# EAGLE design robo-tito2Eric (EAGLE 7.5.0)
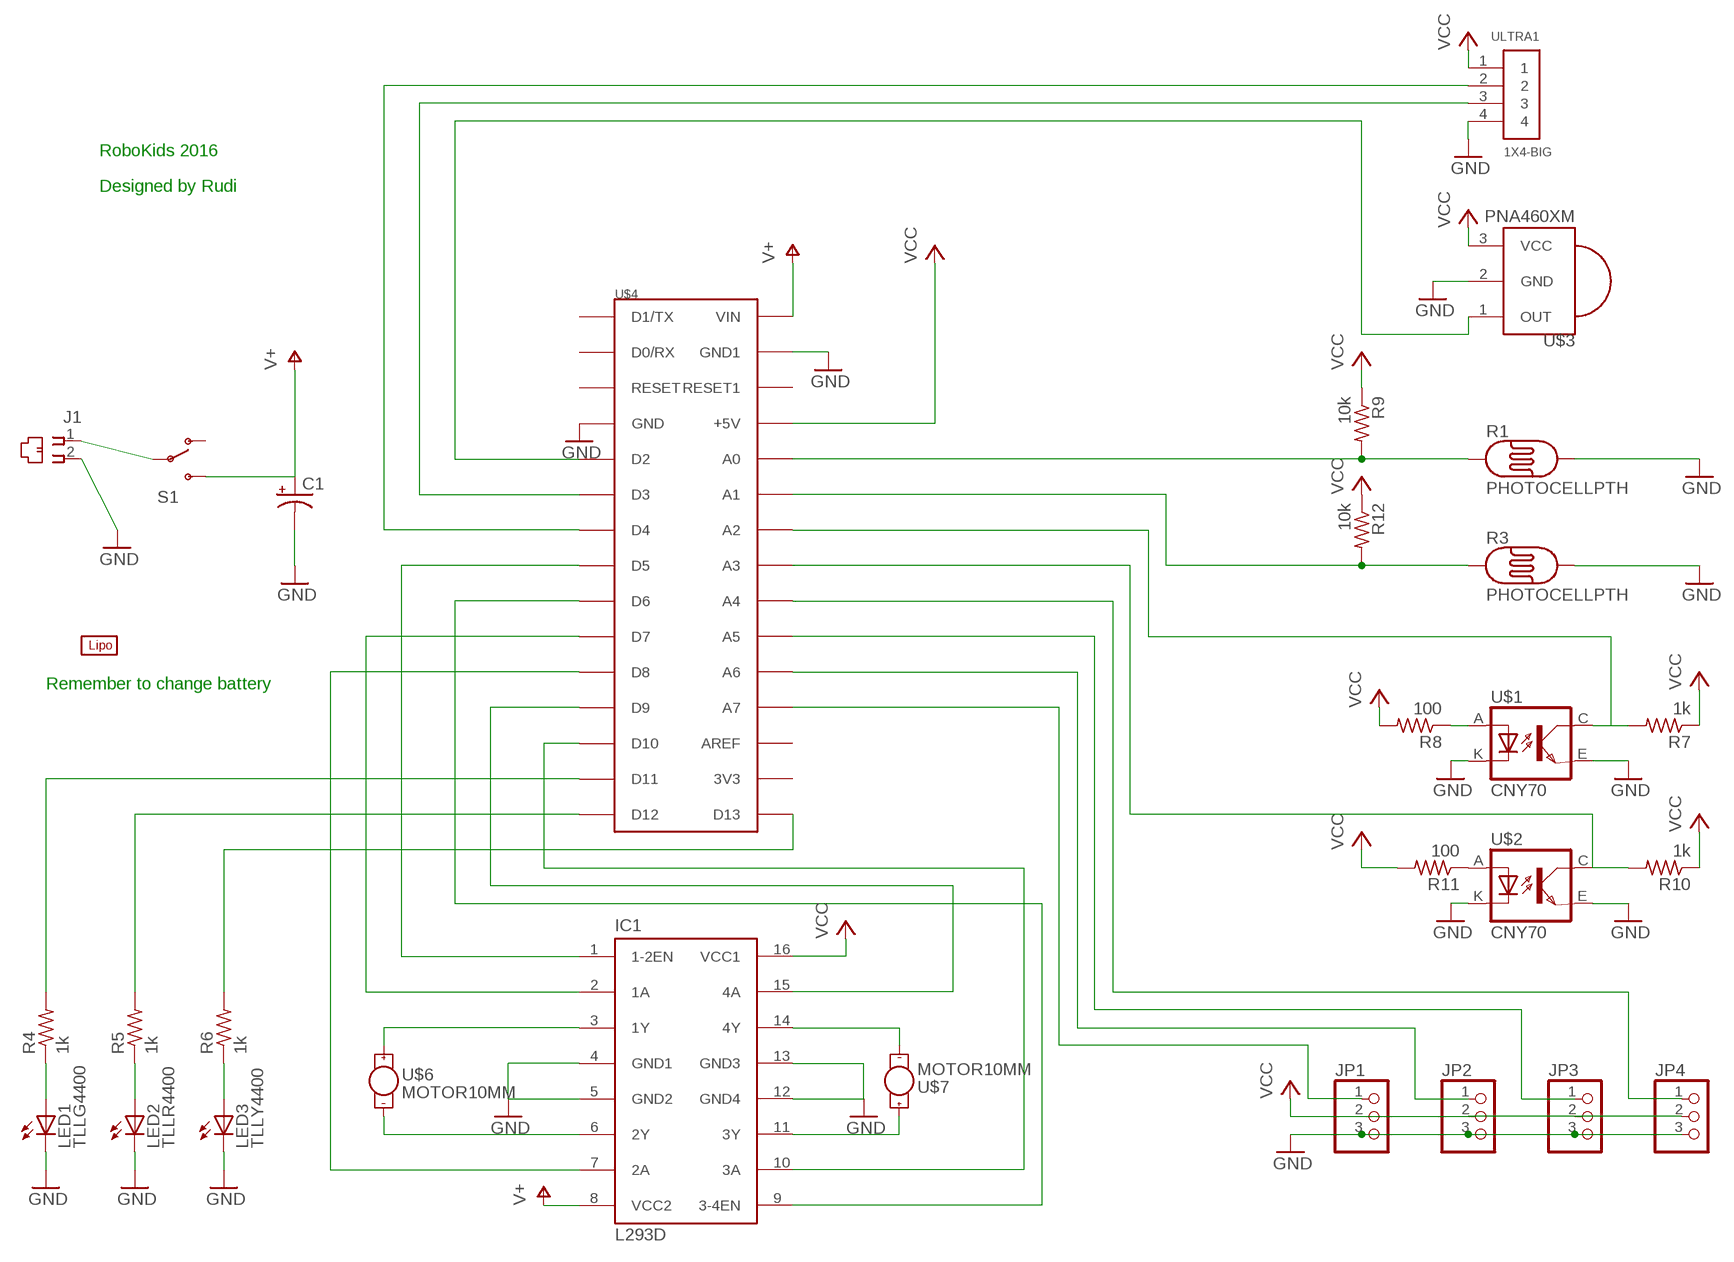
[diagram p0: schematic, sheet 1]

## Parts
C1  CPOL-USE10-20  [EB20D]
IC1  L293D  [DIL16]
J1  215876-7  [215876-7]
JP1  PINHD-1X3  [1X03]
JP2  PINHD-1X3  [1X03]
JP3  PINHD-1X3  [1X03]
JP4  PINHD-1X3  [1X03]
LED1  TLLG4400  [LED3MM]
LED2  TLLR4400  [LED3MM]
LED3  TLLY4400  [LED3MM]
R1  PHOTOCELLPTH  [PHOTOCELL]
R3  PHOTOCELLPTH  [PHOTOCELL]
R4  1k  R-US_0207/12  [0207/12]
R5  1k  R-US_0207/12  [0207/12]
R6  1k  R-US_0207/12  [0207/12]
R7  1k  R-US_0207/12  [0207/12]
R8  100  R-US_0207/12  [0207/12]
R9  10k  R-US_0207/12  [0207/12]
R10  1k  R-US_0207/12  [0207/12]
R11  100  R-US_0207/12  [0207/12]
R12  10k  R-US_0207/12  [0207/12]
S1  SWITCH-SPDTPTH2  [SWITCHE-DPDT]
U$1  CNY70  [4]
U$2  CNY70  [4]
U$3  PNA460XM  [PNA460XM]
U$4  ARDUINONANO  [PDIP-32]
U$5  LIPO-OUTLINE2000  [LIPO-2000]
U$6  MOTOR10MM  [VIBE-MOTOR-10MM]
U$7  MOTOR10MM  [VIBE-MOTOR-10MM]
ULTRA1  1X4-BIG  [1X04-BIG]

## Nets
GND: C1.- IC1.4(GND1) IC1.5(GND2) IC1.12(GND4) IC1.13(GND3) J1.2 JP1.3 JP2.3 JP3.3 JP4.3 LED1.K(C) LED2.K(C) LED3.K(C) R1.2 R3.2 U$1.E(EMI) U$1.K(C) U$2.E(EMI) U$2.K(C) U$3.2(GND) U$4.GND U$4.GND1 ULTRA1.4
N$1: LED1.A R4.1
N$2: LED2.A R5.1
N$3: LED3.A R6.1
N$4: IC1.2(1A) U$4.D7
N$5: IC1.7(2A) U$4.D8
N$6: IC1.15(4A) U$4.D9
N$7: IC1.10(3A) U$4.D10
N$8: IC1.1(1-2EN) U$4.D5
N$9: IC1.9(3-4EN) U$4.D6
N$10: IC1.3(1Y) U$6.+
N$11: IC1.6(2Y) U$6.-
N$12: IC1.14(4Y) U$7.-
N$13: IC1.11(3Y) U$7.+
N$14: R4.2 U$4.D11
N$15: R5.2 U$4.D12
N$16: R6.2 U$4.D13
N$17: U$4.A3
N$18: R7.2 U$1.C(COL) U$4.A2
N$19: R11.1 U$2.A
N$20: U$3.1(OUT) U$4.D2
N$21: J1.1 S1.2(P)
N$22: R8.1 U$1.A
N$23: JP1.1 U$4.A7
N$24: R1.1 R9.2 U$4.A0
N$25: R3.1 R12.2 U$4.A1
N$26: R10.2 U$2.C(COL)
N$27: U$4.D4 ULTRA1.2
N$28: U$4.D3 ULTRA1.3
N$29: JP2.1 U$4.A6
N$30: JP3.1 U$4.A5
N$31: JP4.1 U$4.A4
V+: C1.+ IC1.8(VCC2) S1.3(S) U$4.VIN
VCC: IC1.16(VCC1) JP1.2 JP2.2 JP3.2 JP4.2 R7.1 R8.2 R9.1 R10.1 R11.2 R12.1 U$3.3(VCC) U$4.+5V ULTRA1.1
Unconnected: S1.1(O) U$4.3V3 U$4.AREF U$4.D0/RX U$4.D1/TX U$4.RESET U$4.RESET1

## Notes on the sheet
- RoboKids 2016
- Designed by Rudi
- Remember to change battery

## Library data of the parts
C1 = adafruit:CPOL-US: POLARIZED CAPACITOR, American symbol
IC1 = st-microelectronics:L293D: PUSH-PULL 4 CHANNEL DRIVER; MPN: L293D; OC_FARNELL: 9589619; OC_NEWARK: 56P8249
J1 = con-amp:215876-7: AMP connector
JP1-JP4 = adafruit:PINHD-1X3: PIN HEADER
LED1 = led:TLLG4400: Low Current (2mA) LED 3 mm Tinted Diffused Package color GREEN Source: Data sheet <http://www.farnell.com/datasheets/391098.pdf>; MF: VISHAY SEMICONDUCTOR; OC_FARNELL: 1612435
LED2 = led:TLLR4400: Low Current (2mA) LED 3 mm Tinted Diffused Package color RED Source: Data sheet <http://www.farnell.com/datasheets/391100.pdf>; MF: VISHAY SEMICONDUCTOR; OC_FARNELL: 1612437
LED3 = led:TLLY4400: Low Current (2mA) LED 3 mm Tinted Diffused Package color YELLOW Source: Data sheet <http://www.farnell.com/datasheets/391098.pdf>; MF: VISHAY SEMICONDUCTOR; OC_FARNELL: 1612439
R1 R3 = SparkFun-Sensors:PHOTOCELL: CdS photoresistor. This is a low cost way to detect light levels. Resistance decreases with more incoming light. SparkFun SKU: SEN-09088
R4-R12 = adafruit:R-US_: RESISTOR, American symbol
S1 = SparkFun-Electromechanical:SWITCH-SPDT: SPDT Switch Simple slide switch, Spark Fun Electronics SKU : COM-00102 DPDT SMT slide switch, AYZ0202, SWCH-08179
U$1 U$2 = cny70:CNY70
U$3 = adafruit:PNA460XM: IR 38KHz receiver PNA4602 and related receivers http://www.ladyada.net/library/pcb/eaglelibrary.html
U$4 = jet-lib:ARDUINONANO: This is a simple part to represent Arduino NANO clon.
U$5 = SparkFun-Electromechanical:LIPO-OUTLINE: Outlines for common LiPo batteries sold by SparkFun. For fit only- no pads or connectors!
U$6 U$7 = SparkFun-Electromechanical:MOTOR: Vibration Motor- ROB-08449 Physical dimension and wire connections for this powerful vibration motor. Motor has a self adhesive backing.
ULTRA1 = adafruit:1X4: 4-pin connector

## Board
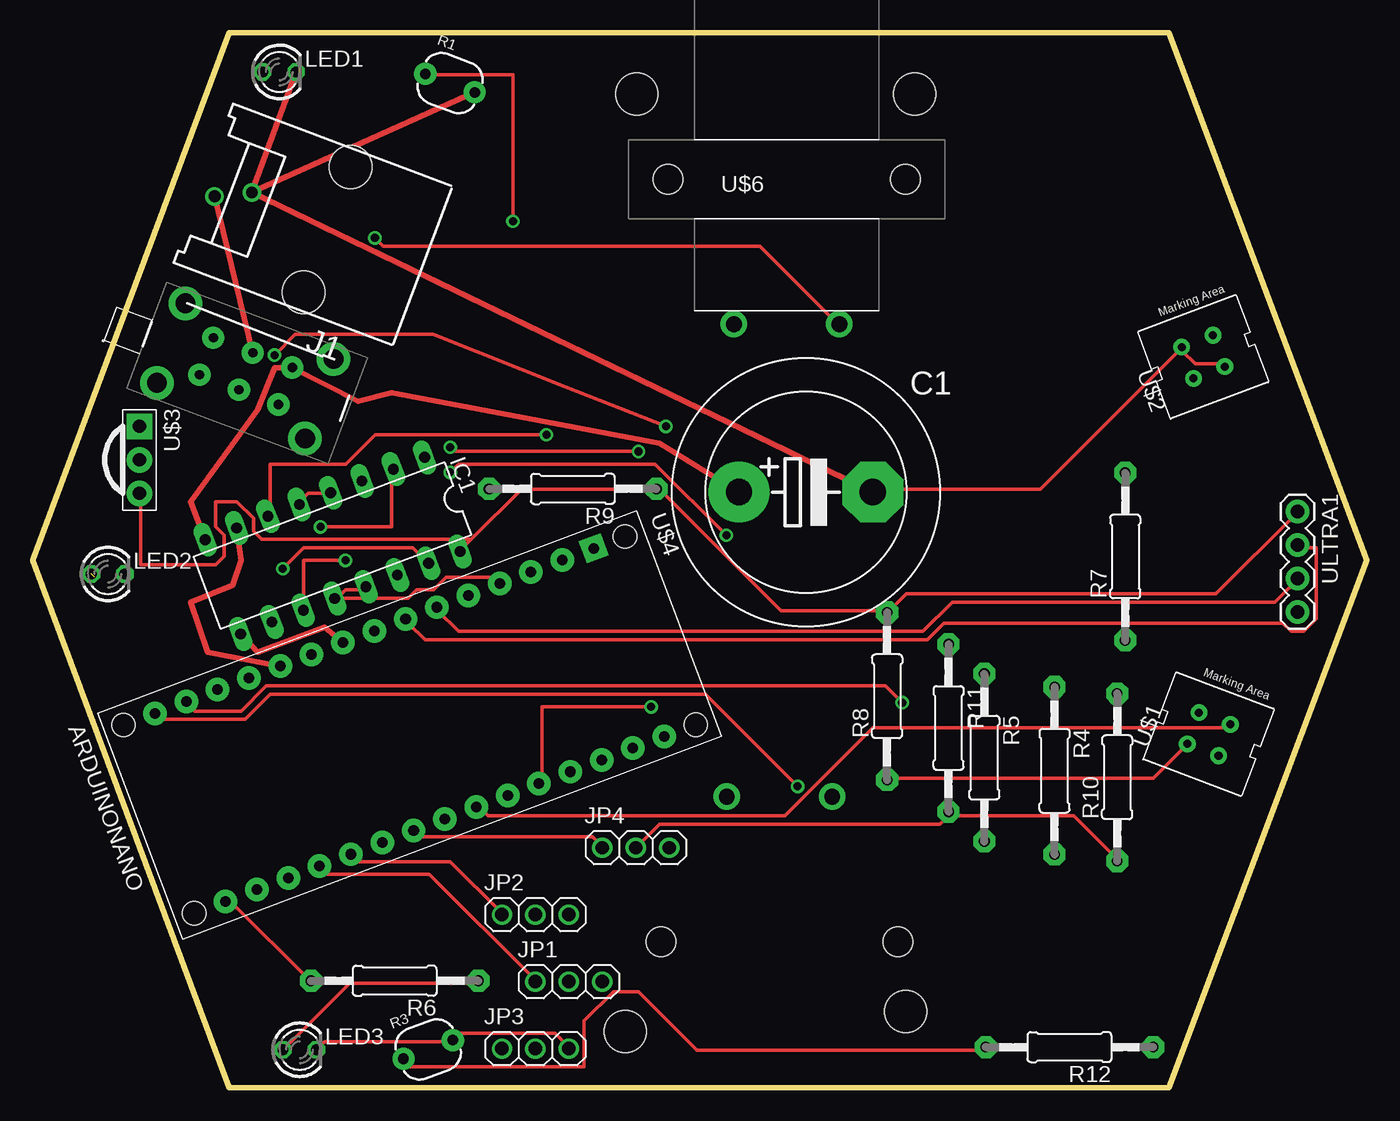
[diagram p1: board, top side]
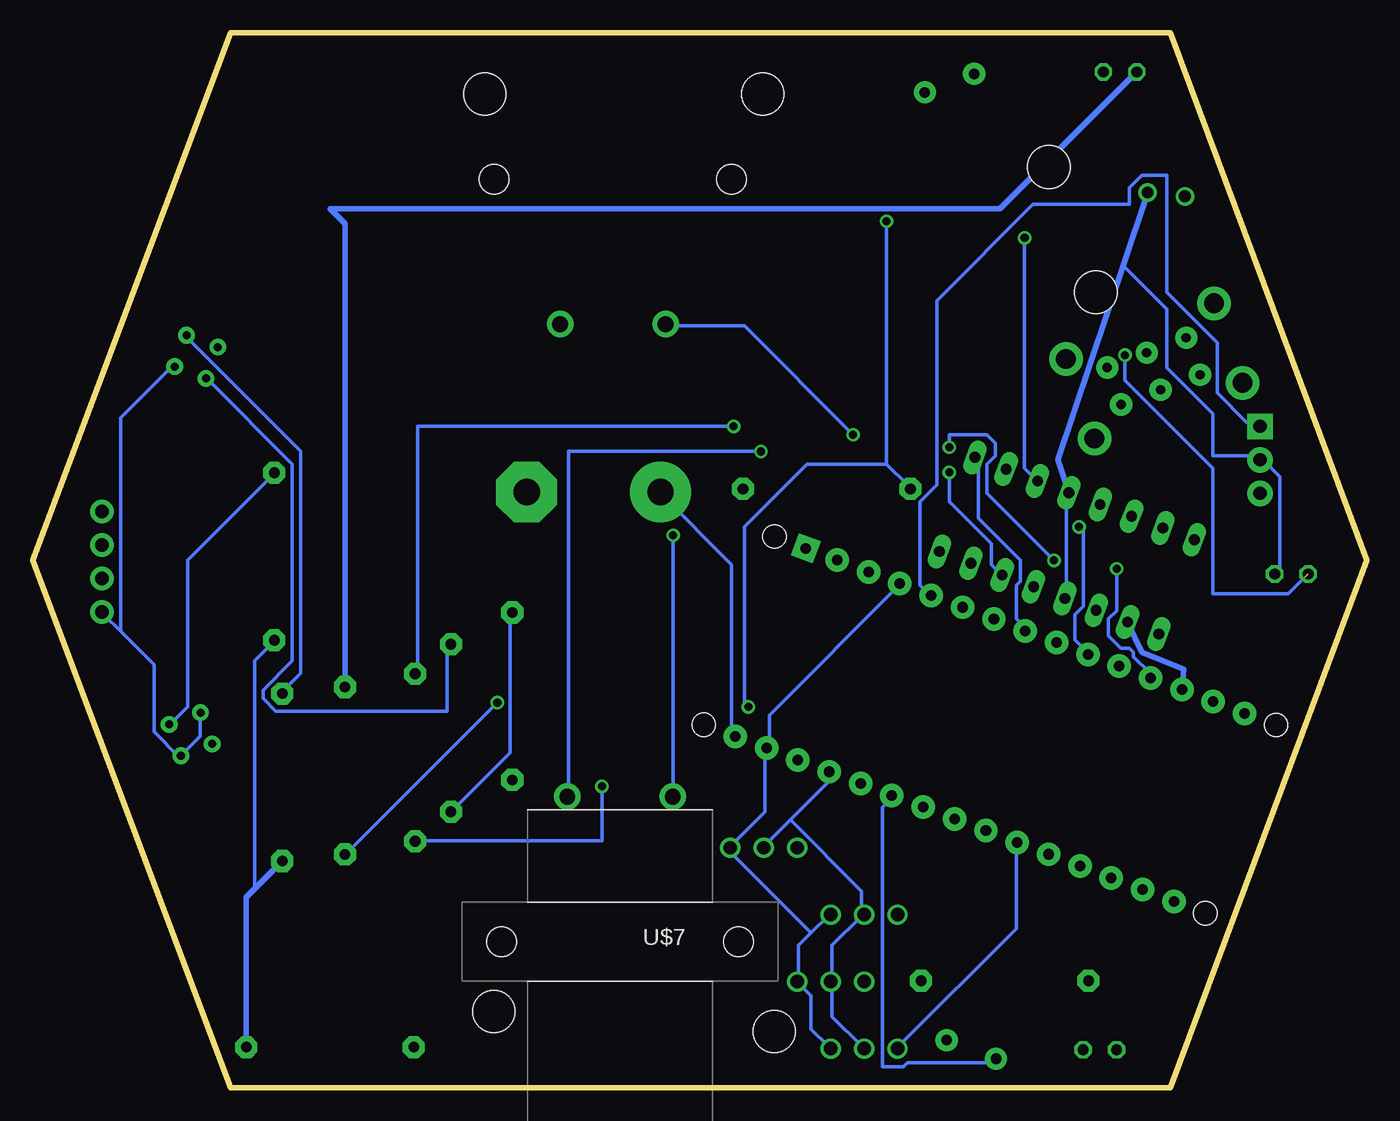
[diagram p2: board, bottom side, seen from below]

Size 101.17 x 80 mm. Coordinates in mm from the lower left corner, seen from the top.
Outline: 14.91,0 86.17,0 101.17,40 86.17,80 14.91,80 0,40 14.91,0
Copper layers (1*16): Top 0.035mm / dielectric 1.5mm / Bottom 0.035mm
Design rules "default": minimum track width 10mil, minimum drill 24mil, track to track 8mil, track to pad 8mil, pad to pad 8mil, via to via 8mil, smd to smd 8mil, copper to edge 40mil, drill to drill 8mil, minimum pad ring 10mil, minimum via ring 8mil, stop-mask expansion 4mil, vias tented up to drill 0mil, thermal gap 10mil
Holes 3.2 mm at 66.19,5.8 44.95,4.26 45.79,75.38 66.89,75.38

### Footprints (pad centres in the part's own frame; a part is rotated, then mirrored left to right if it is on the bottom)
EB20D = drill 2.007 pad 4.597: + -5.08,0 | drill 2.007 pad 4.597 octagon: - 5.08,0
DIL16 = drill 0.813 long: 1 -8.89,-3.81; 2 -6.35,-3.81; 3 -3.81,-3.81; 4 -1.27,-3.81; 5 1.27,-3.81; 6 3.81,-3.81; 7 6.35,-3.81; 8 8.89,-3.81; 9 8.89,3.81; 10 6.35,3.81; 11 3.81,3.81; 12 1.27,3.81; 13 -1.27,3.81; 14 -3.81,3.81; 15 -6.35,3.81; 16 -8.89,3.81
215876-7 = drill 0.889: 1 -0.635,8.89; 2 0.635,6.35 | hole 3.251: -5.08,0; 5.08,0
1X03 = drill 1.016: 1 -2.54,0; 2 0,0; 3 2.54,0
LED3MM = drill 0.813 octagon: A -1.27,0; K 1.27,0
PHOTOCELL = drill 0.8 pad 1.676: 1 -2,0; 2 2,0
0207/12 = drill 0.813 pad 1.676 octagon: 1 -6.35,0; 2 6.35,0
SWITCHE-DPDT = drill 0.7 pad 1.676: 1 -3.2,1.5; 2 0,1.5; 3 3.2,1.5; 4 -3.2,-1.5; 5 0,-1.5; 6 3.2,-1.5 | drill 1.5 pad 2.54: P$1 -6.1,3.2; P$2 -6,-3.2; P$3 6,-3.2; P$4 5.9,3.2
4 = drill 0.61 pad 1.27: A -1.27,1.27; C 1.27,-1.27; E 1.27,1.27; K -1.27,-1.27
PNA460XM = drill 1.016 pad 1.93 square: 1 -2.54,0 | drill 1.016 pad 1.93: 2 0,0; 3 2.54,0
PDIP-32 = drill 0.8 pad 1.778: 3V3 15.24,-35.56; +5V 15.24,-10.16; A0 15.24,-12.7; A1 15.24,-15.24; A2 15.24,-17.78; A3 15.24,-20.32; A4 15.24,-22.86; A5 15.24,-25.4; A6 15.24,-27.94; A7 15.24,-30.48; AREF 15.24,-33.02; D0/RX 0,-5.08; D2 0,-12.7; D3 0,-15.24; D4 0,-17.78; D5 0,-20.32; D6 0,-22.86; D7 0,-25.4; D8 0,-27.94; D9 0,-30.48; D10 0,-33.02; D11 0,-35.56; D12 0,-38.1; D13 15.24,-38.1; GND 0,-10.16; GND1 15.24,-5.08; RESET 0,-7.62; RESET1 15.24,-7.62; VIN 15.24,-2.54 | drill 0.8 pad 1.778 square: D1/TX 0,-2.54 | hole 1.778: 0,0; 0,-40.64; 15.24,-40.64; 15.24,0
VIBE-MOTOR-10MM = drill 1.2 pad 2: + 13,-11; - 5,-11 | hole 2.25: 0,0; 18,0
1X04-BIG = drill 1.016 pad 1.778: 1 0,0; 2 2.54,0; 3 5.08,0; 4 7.62,0

### Placement (x,y rotation side)
C1  58.64,45.18 0 top
IC1  22.73,41.12 200.6 top
J1  22.32,65.08 69.4 top
JP1  40.65,8.05 0 top
JP2  38.11,13.13 0 top
JP3  38.11,2.97 0 top
JP4  45.73,18.21 0 top
LED1  18.7,77.05 0 top
LED2  5.69,38.97 0 top
LED3  20.23,2.89 0 top
R1  31.64,76.2 339.4 top
R3  29.98,2.91 20.6 top
R4  77.5,24.05 270 top
R5  72.17,25.05 270 top
R6  27.45,8.12 180 top
R7  82.86,40.29 90 top
R8  64.81,29.7 90 top
R9  40.95,45.42 180 top
R10  82.25,23.55 90 top
R11  69.47,27.29 270 top
R12  78.63,3.09 180 top
S1  16.16,54.35 339.4 top
U$1  89.2,26.82 69.4 top
U$2  88.78,55.44 110.6 top
U$3  8.08,47.63 270 top
U$4  44.91,41.81 290.6 top
U$5  -71.03,6.27 0 top  (outside the outline)
U$6  48.17,68.92 0 top
U$7  47.63,11.08 180 bottom
ULTRA1  95.92,43.71 270 top

### Tracks (layer width: path | path; a pad name or v marks a point on that pad's centre or on a via)
GND
  Top 0.254: LED3.K 21.81,3.17 22.13,3.49 31.66,3.49 R3.2 31.97,3.81 32.29,4.13 39.59,4.13 40.54,3.17 JP3.3 | U$2.K 90.39,54.93 88.17,54.93 87.22,55.88 U$2.E 86.9,55.88 76.42,45.4 64.04,45.4 C1.- | IC1.5 20.23,44.45 20.86,45.09 22.45,45.09 IC1.4 | 23.08,37.15 23.72,37.78 24.99,37.78 IC1.13 | 23.08,37.15 28.48,37.15 29.12,37.78 30.39,37.78 31.34,38.73 34.83,38.73 35.15,38.42 U$4.GND | 23.08,37.15 IC1.12
  Top 0.406: J1.2 R1.2 | J1.2 LED1.K | J1.2 C1.-
  Bottom 0.254: JP3.3 40.86,3.17 42.13,4.45 42.13,6.99 43.08,7.94 JP1.3 43.08,8.26 43.08,10.79 42.13,11.75 | 42.13,11.75 40.86,13.02 JP2.3 | U$4.GND 35.46,38.1 45.31,28.26 45.31,26.04 U$4.GND1 45.62,25.72 45.62,20.95 48.16,18.41 JP4.3 48.16,18.1 48.16,17.78 42.13,11.75 | U$1.E 88.49,28.26 88.49,26.67 89.76,25.4 U$1.K 90.08,25.08 91.98,26.99 91.98,32.07 94.52,34.61 | 94.52,34.61 95.79,35.88 ULTRA1.4 | 94.52,34.61 94.52,50.8 90.71,54.61 U$2.K | LED2.K 6.89,39.05 6.57,39.37 6.57,46.35 7.84,47.62 U$3.2 8.16,47.94 11.65,47.94 11.65,51.12 15.15,54.61 15.15,59.05 18.32,62.23 18.49,62.29 | IC1.4 22.77,45.09 22.77,37.15 IC1.12
  Bottom 0.406: J1.2 18.49,62.29 23.4,47.62 IC1.4
N$1
  Bottom 0.406: LED1.A 27.8,66.67 78.64,66.67 77.5,65.53 R4.1
N$2  (via drill 0.61)  (1 unrouted)
  Top 0.254: v18.32,55.56 19.91,57.15 30.37,57.15 40.35,53.16 v48.02,50.16
  Bottom 0.254: 4.67,38.73 5.94,37.47 11.65,37.47 11.65,46.99 18.32,53.66 v18.32,55.56 | v48.02,50.16 71.98,50.16 71.98,31.43 R5.1
N$3
  Top 0.254: LED3.A 19.27,3.17 24.04,7.94 33.56,7.94 R6.1
N$4  (via drill 0.61)
  Top 0.254: v21.81,42.55 27.21,42.55 27.21,46.67 IC1.2
  Bottom 0.254: v21.81,42.55 21.5,42.23 21.5,36.51 22.13,35.88 22.13,33.97 21.18,33.02 U$4.D7
N$5
  Top 0.406: U$4.D8 13.24,33.02 11.97,36.83 15.15,38.1 15.78,40.01 IC1.7
N$6  (via drill 0.61)
  Top 0.254: v18.96,39.37 20.54,40.96 28.8,40.96 29.75,40.01 IC1.15
  Bottom 0.254: v18.96,39.37 18.96,36.2 19.59,35.56 19.59,34.29 18.64,33.34 18,33.34 17.69,33.02 17.69,32.7 16.41,31.43 16.41,31.11 U$4.D9
N$7
  Bottom 0.406: IC1.10 17.05,33.02 13.88,31.75 U$4.D10
N$8
  Bottom 0.254: IC1.1 29.43,47.62 29.43,43.18 26.26,40.01 26.26,38.42 26.57,38.1 26.57,35.56 25.94,34.92 U$4.D5
N$9
  Top 0.406: IC1.9 17.05,33.02 22.13,34.92 U$4.D6
N$10  (via drill 0.61)
  Top 0.254: v25.94,64.45 26.57,63.82 55.15,63.82 60.86,58.1 U$6.+
  Bottom 0.254: v25.94,64.45 25.94,46.99 24.99,46.04 IC1.3
N$11  (via drill 0.61)
  Top 0.254: v38.96,49.53 25.94,49.53 23.72,47.31 18,47.31 18,43.5 IC1.6
  Bottom 0.254: v38.96,49.53 47.21,57.78 52.93,57.78 U$6.-
N$12  (via drill 0.61)
  Top 0.254: v31.66,46.67 32.29,47.31 47.21,47.31 v52.61,41.91
  Bottom 0.254: v31.66,46.67 31.66,44.45 28.48,41.27 28.48,39.69 27.85,39.05 IC1.14 | v52.61,41.91 52.61,22.23 U$7.-
N$13  (via drill 0.61)
  Top 0.254: v23.72,40.01 20.54,40.01 20.54,36.51 IC1.11 | v31.66,48.58 31.97,48.26 v45.94,48.26
  Bottom 0.254: v23.72,40.01 28.8,45.09 28.8,47.31 28.16,47.94 28.16,48.9 28.8,49.53 31.66,49.53 v31.66,48.58 | v45.94,48.26 60.55,48.26 60.55,22.23 U$7.+
N$14  (via drill 0.61)
  Top 0.254: v65.94,29.21 64.67,30.48 17.69,30.48 15.78,28.57 12.29,28.57 11.65,29.21 U$4.D11
  Bottom 0.254: v65.94,29.21 77.38,17.78 R4.2
N$15  (via drill 0.61)
  Top 0.254: v58.01,22.86 51.02,29.84 18,29.84 16.1,27.94 9.75,27.94 9.43,28.26 U$4.D12
  Bottom 0.254: v58.01,22.86 58.01,18.73 71.98,18.73 R5.2
N$16
  Top 0.254: R6.2 20.86,8.26 15.15,13.97 14.83,13.97 U$4.D13
N$18
  Top 0.254: U$4.A2 33.88,21.27 34.51,20.64 57.05,20.64 63.72,27.3 90.71,27.3 U$1.C
  Bottom 0.254: U$1.C 90.71,27.62 89.44,28.89 89.44,40.01 83.09,46.35 R7.2
N$19
  Bottom 0.254: U$2.A 87.85,53.66 81.5,47.31 81.5,32.38 83.72,30.16 83.72,29.53 82.77,28.57 69.75,28.57 69.75,33.34 R11.1
N$20
  Bottom 0.254: U$4.D2 33.24,37.47 33.88,38.1 33.88,44.45 32.61,45.72 32.61,59.69 25.3,66.99 18,66.99 18,68.26 17.05,69.22 15.15,69.22 15.15,60.33 11.34,56.52 11.34,52.7 9.11,50.48 8.16,50.48 U$3.1
N$21
  Top 0.406: S1.2 J1.1
N$22
  Top 0.254: U$1.A 87.53,26.04 84.99,23.5 64.99,23.5 R8.1
N$23
  Top 0.254: JP1.1 38,8.26 30.07,16.19 22.13,16.19 21.81,16.51 U$4.A7
N$24  (via drill 0.61)
  Top 0.254: v36.42,65.72 36.42,76.83 30.07,76.83 R1.1 | v46.89,28.89 38.64,28.89 38.64,23.18 U$4.A0
  Bottom 0.254: 36.42,47.31 34.83,45.72 R9.2 | v36.42,65.72 36.42,47.31 | v46.89,28.89 47.21,29.21 47.21,42.55 42.45,47.31 36.42,47.31
N$25
  Top 0.254: R12.2 71.98,2.86 50.39,2.86 45.94,7.3 44.04,7.3 41.81,5.08 41.81,1.59 28.48,1.59 28.16,1.91 R3.1
  Bottom 0.254: R3.1 28.16,1.91 34.83,1.91 35.15,1.59 36.73,1.59 36.73,21.27 36.1,21.91 U$4.A1
N$26
  Bottom 0.254: U$2.C 89.44,56.83 80.87,48.26 80.87,31.43 82.14,30.16 R10.2
N$27
  Top 0.254: U$4.D4 28.48,35.24 29.75,33.97 67.85,33.97 69.12,35.24 94.84,35.24 95.47,34.61 96.42,34.61 97.38,35.56 97.38,40.96 96.11,40.96 ULTRA1.2
N$28
  Top 0.254: U$4.D3 30.7,36.2 32.29,34.61 67.53,34.61 69.75,36.83 94.2,36.83 95.79,38.42 ULTRA1.3
N$29
  Top 0.254: JP2.1 35.46,13.34 31.66,17.14 24.67,17.14 24.35,17.46 U$4.A6
N$30
  Bottom 0.254: JP3.1 35.46,3.17 26.57,12.06 26.57,18.41 U$4.A5
N$31
  Top 0.254: JP4.1 43.08,18.41 42.45,19.05 29.43,19.05 29.12,19.37 U$4.A4
V+
  Top 0.406: IC1.8 11.97,44.45 17.05,51.44 18.32,54.61 S1.3 24.67,52.07 27.21,52.7 47.53,48.9 C1.+
  Bottom 0.254: U$4.VIN 48.16,26.67 48.16,39.69 53.56,45.09 C1.+
VCC
  Top 0.254: 33.24,41.59 37.05,45.4 47.21,45.4 R9.1 47.53,45.4 56.74,36.2 64.67,36.2 R8.2 64.99,36.2 66.26,37.47 89.76,37.47 95.79,43.5 ULTRA1.1 | 33.24,41.59 32.61,40.96 IC1.16 | 33.24,41.59 17.37,41.59 16.73,42.23 16.73,43.18 15.46,44.45 13.88,44.45 13.88,42.55 14.51,41.91 14.51,40.32 13.88,39.69 8.16,39.69 8.16,45.09 U$3.3 | R10.1 82.14,17.46 78.96,20.64 69.75,20.64 R11.2 69.44,20.64 68.8,20 47.53,20 45.94,18.41 JP4.2
  Bottom 0.254: 43.72,20.32 40.86,23.18 40.86,23.81 U$4.+5V | 43.72,20.32 45.62,18.41 JP4.2 | JP3.2 38.32,3.17 40.54,5.4 40.54,7.94 JP1.2 40.54,8.26 40.54,10.79 38.32,13.02 JP2.2 38.32,13.34 38.32,14.92 43.72,20.32 | 84.99,3.17 R12.1 | R7.1 83.09,33.66 84.36,32.38 84.36,15.24 84.29,15.17 | R8.2 64.99,35.88 64.99,25.4 69.44,20.95 R11.2
  Bottom 0.406: R10.1 84.29,15.17 84.99,14.46 84.99,3.17 84.99,2.54

### Text on the board
tDocu: Robot
bDocu: Eric Wu